# EAGLE design PCB_SCH_1 (EAGLE 8.7.0)
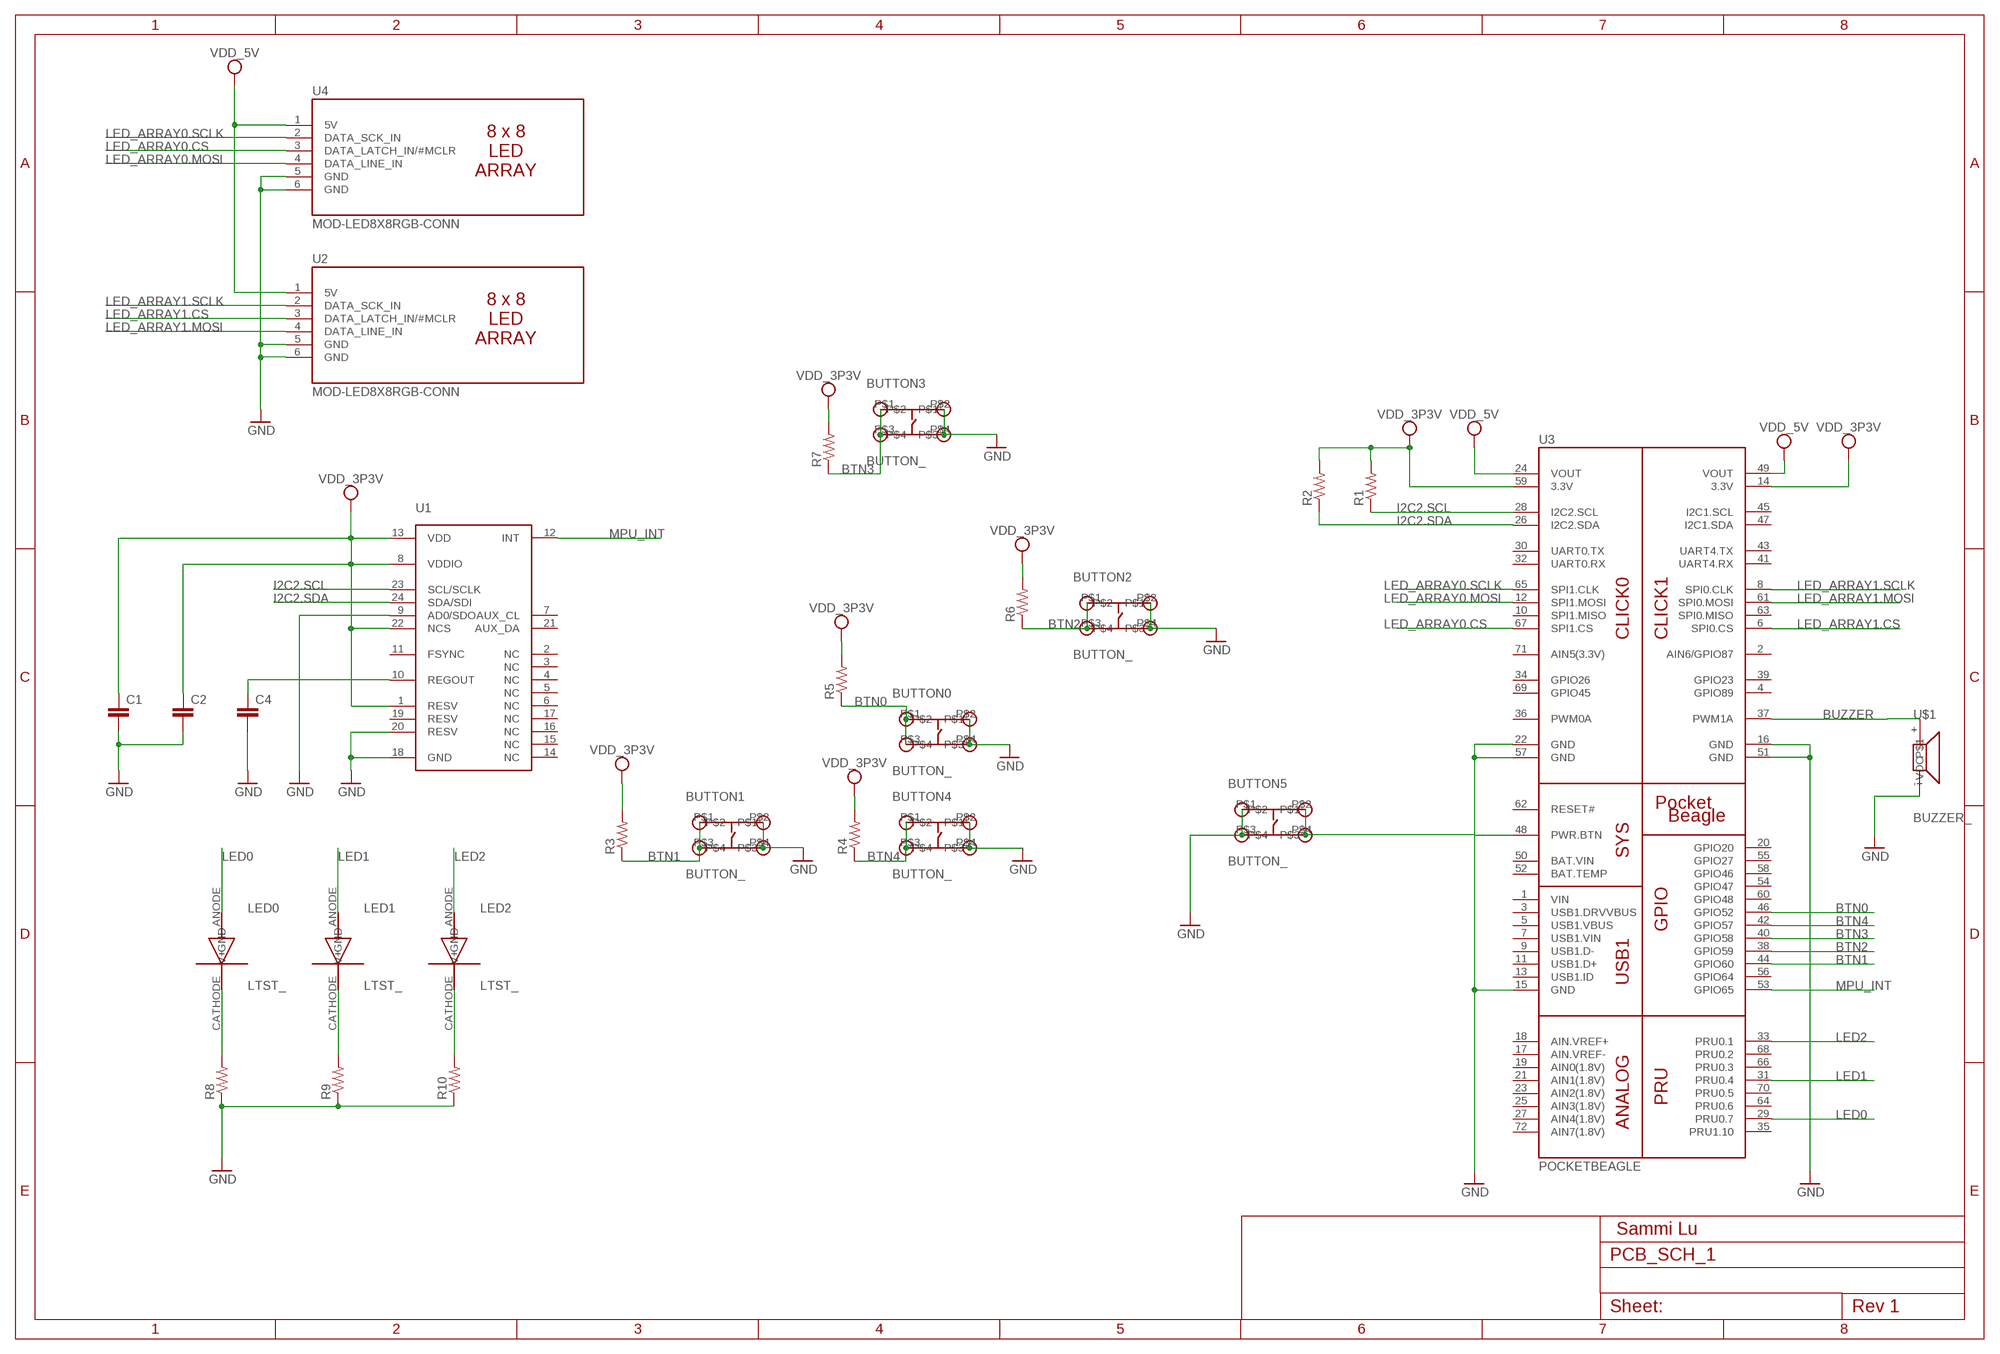
[diagram p0: schematic, sheet 1]

## Parts
BUTTON0  BUTTON_  [115*117]
BUTTON1  BUTTON_  [115*117]
BUTTON2  BUTTON_  [115*117]
BUTTON3  BUTTON_  [115*117]
BUTTON4  BUTTON_  [115*117]
BUTTON5  BUTTON_  [115*117]
C1  C_C0603  [C0603]
C2  C_C0603  [C0603]
C4  C_C0603  [C0603]
LED0  LTST_  [1.6*0.8]
LED1  LTST_  [1.6*0.8]
LED2  LTST_  [1.6*0.8]
R1  R_R2012  [R2012]
R2  R_R2012  [R2012]
R3  R_R2012  [R2012]
R4  R_R2012  [R2012]
R5  R_R2012  [R2012]
R6  R_R2012  [R2012]
R7  R_R2012  [R2012]
R8  R_R1005  [R1005]
R9  R_R1005  [R1005]
R10  R_R1005  [R1005]
U1  MPU_9250  [QFN-3MM*3MM]
U2  MOD-LED8X8RGB-CONN  [FE06W]
U3  POCKETBEAGLE  [POCKETBEAGLE]
U4  MOD-LED8X8RGB-CONN  [FE06W]
U$1  BUZZER_  [12CIRCLE]

## Nets
BTN0: BUTTON0.P$1 BUTTON0.P$3 R5.1 U3.46(GPIO52)
BTN1: BUTTON1.P$1 BUTTON1.P$3 R3.1 U3.44(GPIO60)
BTN2: BUTTON2.P$1 BUTTON2.P$3 R6.1 U3.38(GPIO59)
BTN3: BUTTON3.P$1 BUTTON3.P$3 R7.1 U3.40(GPIO58)
BTN4: BUTTON4.P$1 BUTTON4.P$3 R4.1 U3.42(GPIO57)
BUZZER: U3.37(PWM1A) U$1.+(+VDC)
GND: BUTTON0.P$2 BUTTON0.P$4 BUTTON1.P$2 BUTTON1.P$4 BUTTON2.P$2 BUTTON2.P$4 BUTTON3.P$2 BUTTON3.P$4 BUTTON4.P$2 BUTTON4.P$4 BUTTON5.P$1 BUTTON5.P$3 C1.2 C2.2 C4.2 R8.1 R9.1 R10.1 U1.9(AD0/SDO) U1.18(GND) U1.20(RESV) U2.5(GND) U2.6(GND) U3.15(GND) U3.16(GND) U3.48(PWR.BTN) U3.51(GND) U4.5(GND) U4.6(GND) U$1.-
I2C2.SCL: R1.1 U1.23(SCL/SCLK) U3.28(I2C2.SCL)
I2C2.SDA: R2.1 U1.24(SDA/SDI) U3.26(I2C2.SDA)
LED0: LED0.ANODE(V+) U3.29(PRU0.7)
LED1: LED1.ANODE(V+) U3.31(PRU0.4)
LED2: LED2.ANODE(V+) U3.33(PRU0.1)
LED_ARRAY0.CS: U3.67(SPI1.CS) U4.3(DATA_LATCH_IN/#MCLR)
LED_ARRAY0.MOSI: U3.12(SPI1.MOSI) U4.4(DATA_LINE_IN)
LED_ARRAY0.SCLK: U3.65(SPI1.CLK) U4.2(DATA_SCK_IN)
LED_ARRAY1.CS: U2.3(DATA_LATCH_IN/#MCLR) U3.6(SPI0.CS)
LED_ARRAY1.MOSI: U2.4(DATA_LINE_IN) U3.61(SPI0.MOSI)
LED_ARRAY1.SCLK: U2.2(DATA_SCK_IN) U3.8(SPI0.CLK)
MPU_INT: U1.12(INT) U3.53(GPIO65)
N$7: BUTTON5.P$2 BUTTON5.P$4 U3.22(GND) U3.57(GND)
N$30: C4.1 U1.10(REGOUT)
N$32: LED0.CATHODE(GND) R8.2
N$34: LED1.CATHODE(GND) R9.2
N$35: LED2.CATHODE(GND) R10.2
SYS_VDD1_3P3V: C1.1 C2.1 R1.2 R2.2 R3.2 R4.2 R5.2 R6.2 R7.2 U1.1(RESV) U1.8(VDDIO) U1.13(VDD) U1.22(NCS) U3.14(3.3V) U3.59(3.3V) ; supply symbol labelled VDD_3P3V
VDD_5V: U2.1(5V) U3.24(VOUT) U3.49(VOUT) U4.1(5V)
Unconnected: U1.2(NC) U1.3(NC) U1.4(NC) U1.5(NC) U1.6(NC) U1.7(AUX_CL) U1.11(FSYNC) U1.14(NC) U1.15(NC) U1.16(NC) U1.17(NC) U1.19(RESV) U1.21(AUX_DA) U3.1(VIN) U3.2(AIN6/GPIO87) U3.3(USB1.DRVVBUS) U3.4(GPIO89) U3.5(USB1.VBUS) U3.7(USB1.VIN) U3.9(USB1.D-) U3.10(SPI1.MISO) U3.11(USB1.D+) U3.13(USB1.ID) U3.17(AIN.VREF-) U3.18(AIN.VREF+) U3.19(AIN0(1.8V)) U3.20(GPIO20) U3.21(AIN1(1.8V)) U3.23(AIN2(1.8V)) U3.25(AIN3(1.8V)) U3.27(AIN4(1.8V)) U3.30(UART0.TX) U3.32(UART0.RX) U3.34(GPIO26) U3.35(PRU1.10) U3.36(PWM0A) U3.39(GPIO23) U3.41(UART4.RX) U3.43(UART4.TX) U3.45(I2C1.SCL) U3.47(I2C1.SDA) U3.50(BAT.VIN) U3.52(BAT.TEMP) U3.54(GPIO47) U3.55(GPIO27) U3.56(GPIO64) U3.58(GPIO46) U3.60(GPIO48) U3.62(RESET#) U3.63(SPI0.MISO) U3.64(PRU0.6) U3.66(PRU0.3) U3.68(PRU0.2) U3.69(GPIO45) U3.70(PRU0.5) U3.71(AIN5(3.3V)) U3.72(AIN7(1.8V))

## Notes on the sheet
- Sammi Lu

## Library data of the parts
BUTTON0 BUTTON1-BUTTON5 = PCB_design_1:BUTTON_
C1 C2 C4 = PCB_design_1:C_: Capacitor SMD. Sizes: 0402, 0603 & 0805
LED0 LED1 LED2 = PCB_design_1:LTST_
R1-R10 = ENGI301_design_example:R_: RESISTOR, American symbol
U1 = PCB_design_1:MPU_9250
U2 U4 = ENGI301_Maze_Project_Parts:MOD-LED8X8RGB-CONN
U3 = ENGI301_Maze_Project_Parts:POCKETBEAGLE
U$1 = PCB_design_1:BUZZER_

## Board
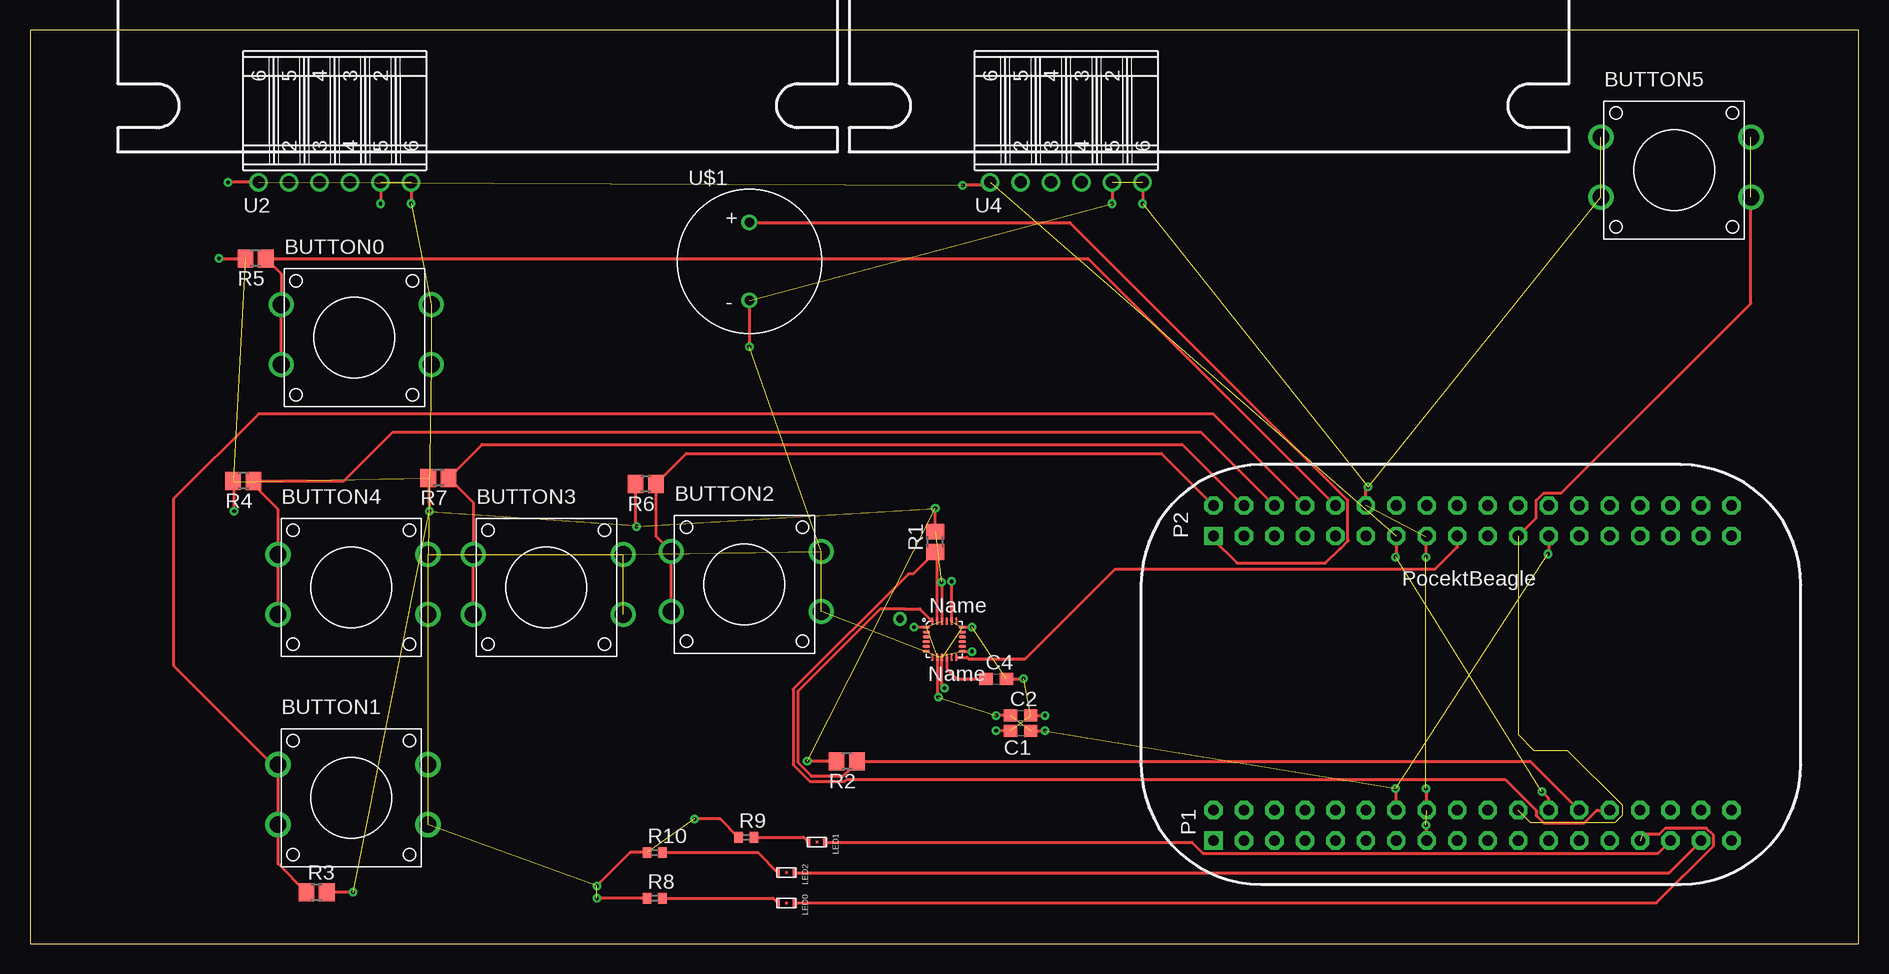
[diagram p1: board, top side]
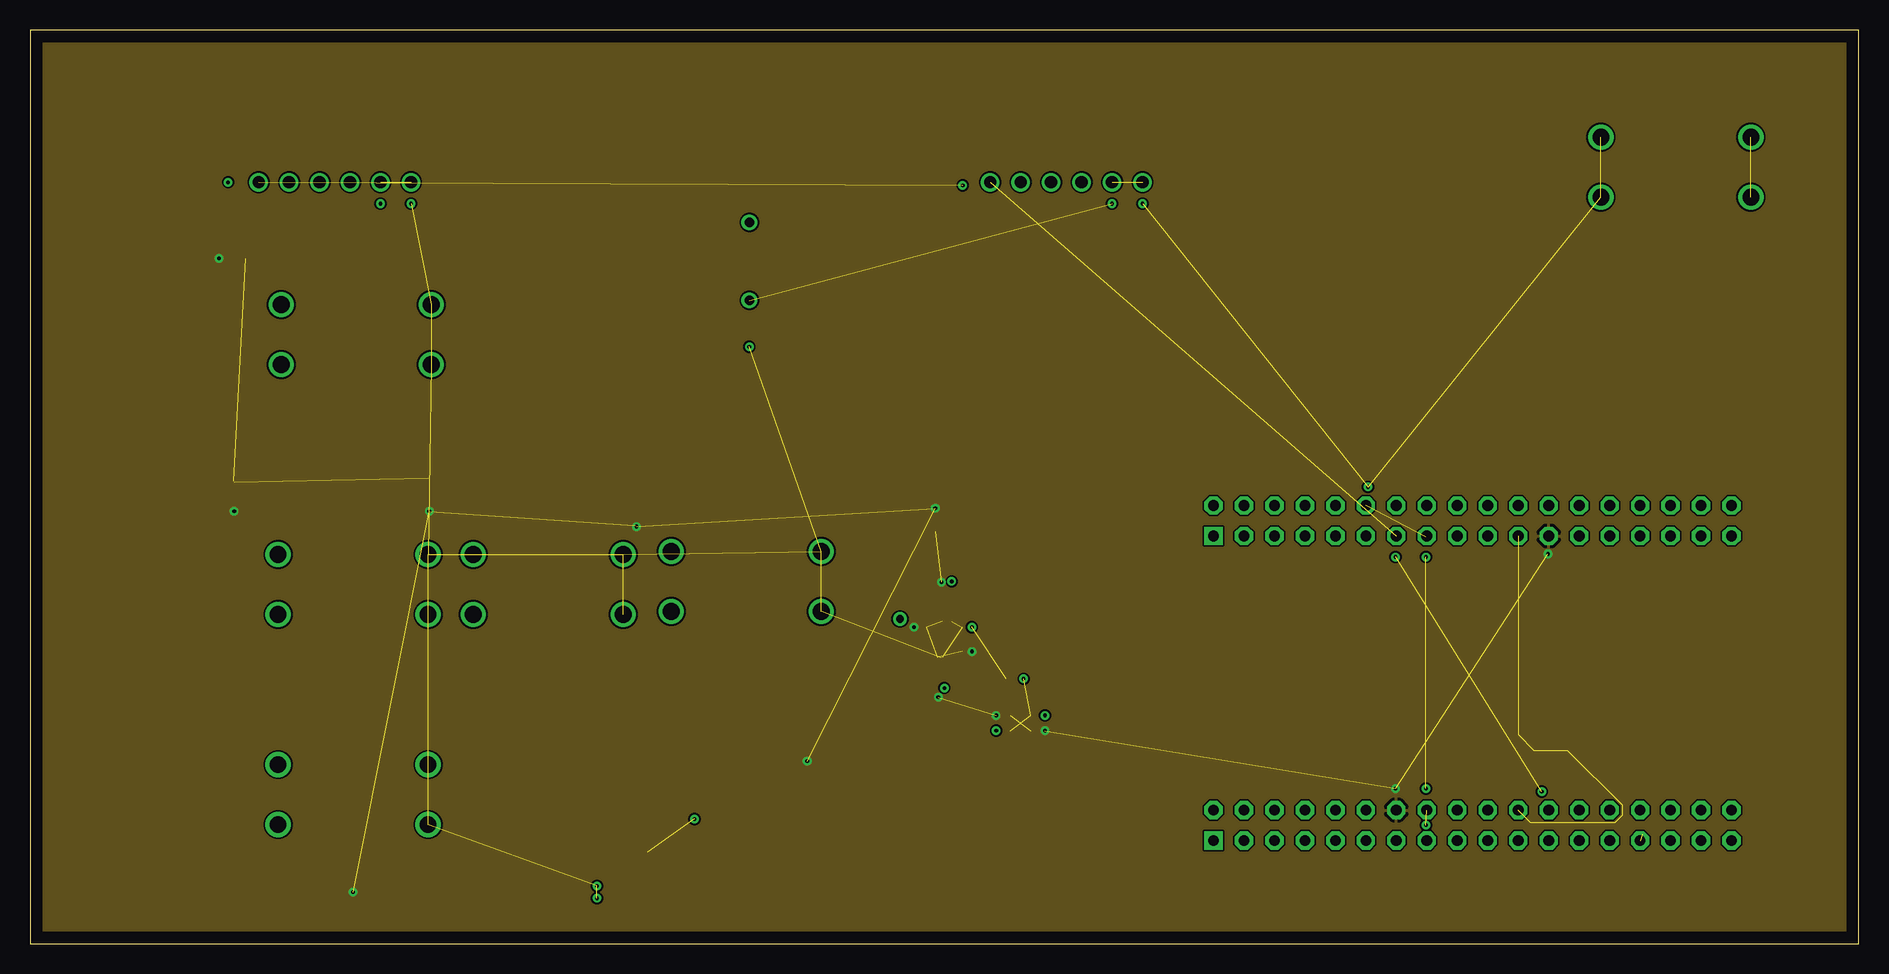
[diagram p2: board, inner layer Route2]
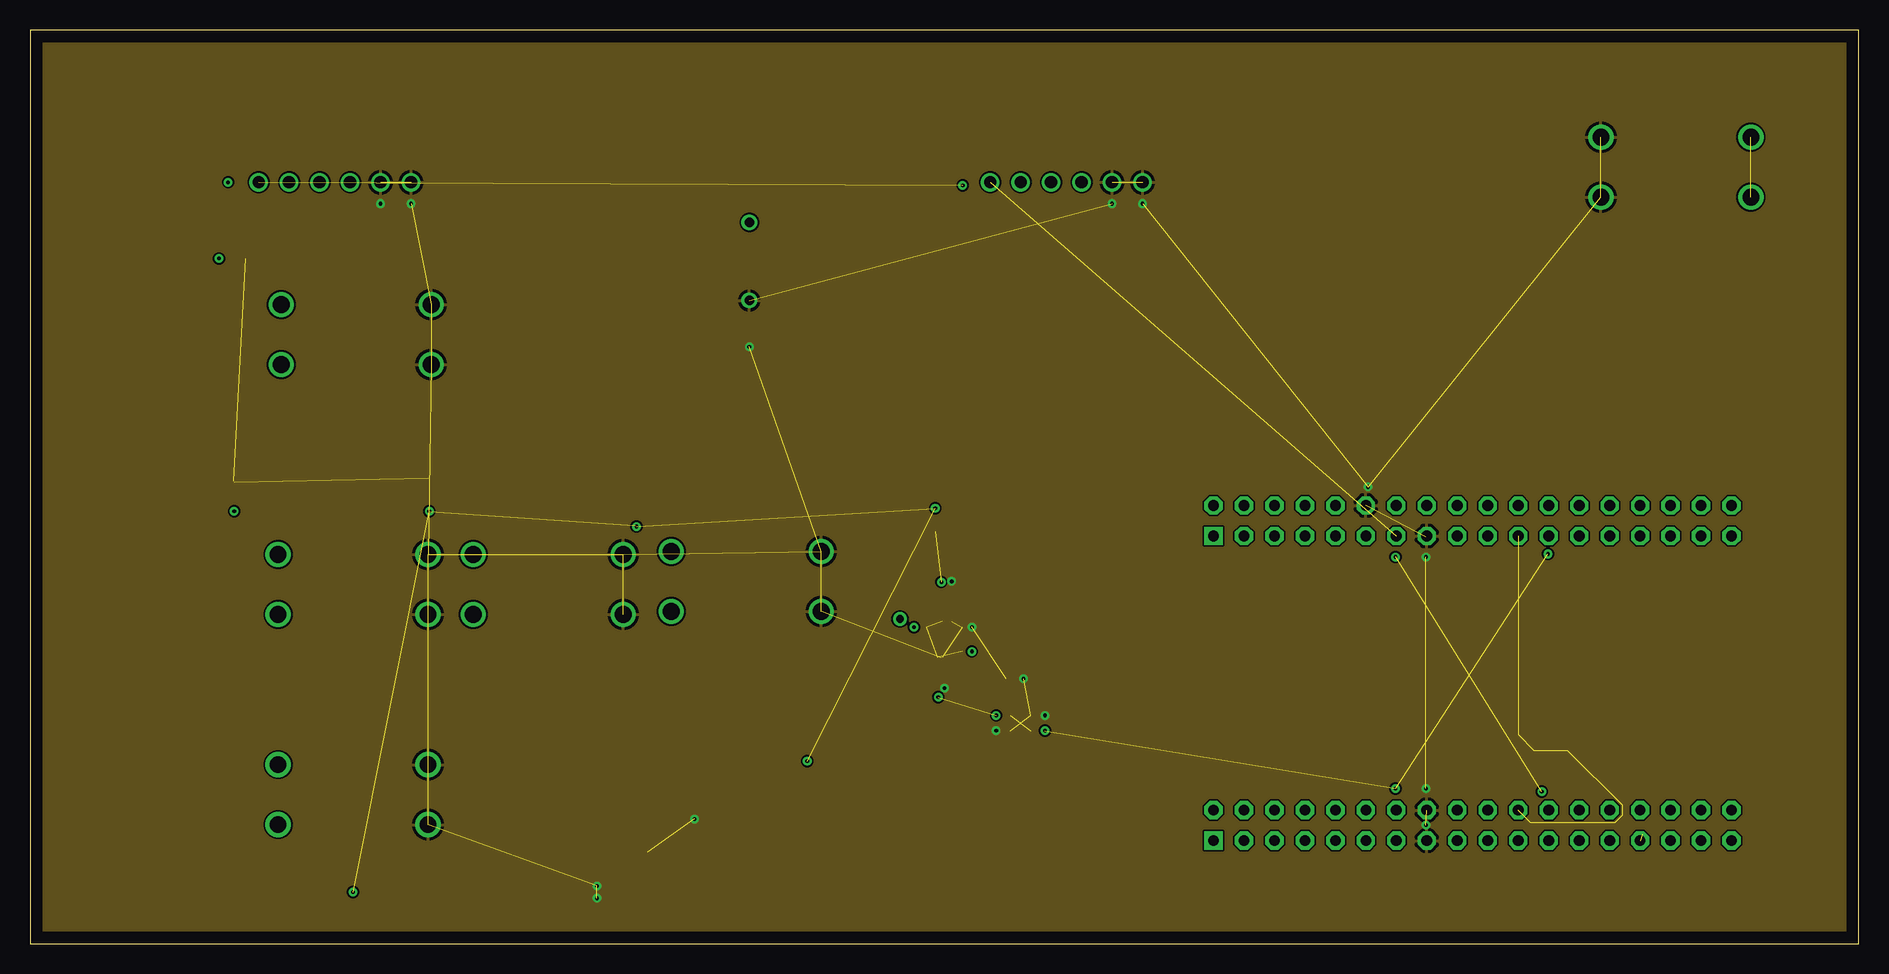
[diagram p3: board, inner layer Route15]
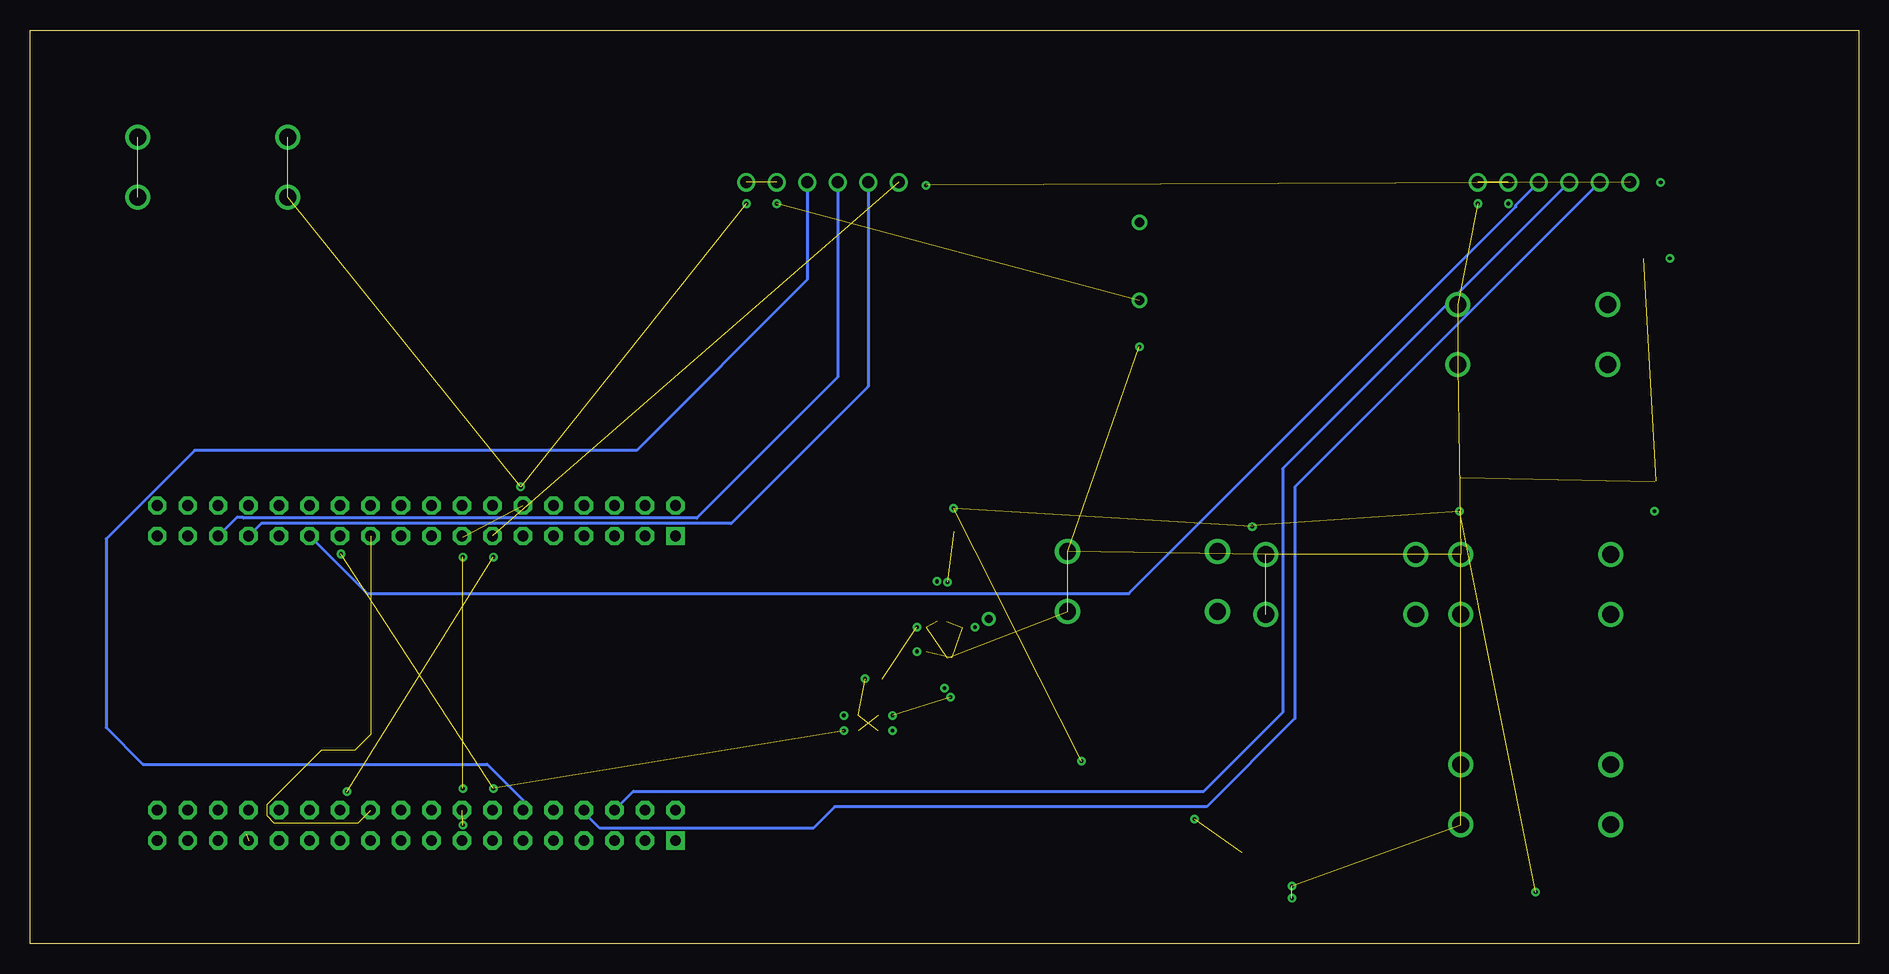
[diagram p4: board, bottom side, seen from below]

Size 152.4 x 76.2 mm. Coordinates in mm from the lower left corner, seen from the top.
Outline: 0,0 152.4,0 152.4,76.2 0,76.2 0,0
Copper layers (1*16): Top 0.035mm / dielectric 1.5mm / Bottom 0.035mm
Design rules "default": minimum track width 6mil, minimum drill 0.35mm, track to track 6mil, track to pad 6mil, pad to pad 6mil, via to via 6mil, smd to smd 6mil, copper to edge 40mil, drill to drill 6mil, minimum pad ring 10mil, minimum via ring 8mil, stop-mask expansion 4mil, vias tented up to drill 0mil, thermal gap 10mil

### Footprints (pad centres in the part's own frame; a part is rotated, then mirrored left to right if it is on the bottom)
115*117 = drill 1.4: P$1 -6.25,2.5; P$2 6.25,2.5; P$3 -6.25,-2.5; P$4 6.25,-2.5
C0603 = smd 1.1 x 1: 1 -0.85,0; 2 0.85,0
1.6*0.8 = smd 0.8 x 0.3: ANODE 0.4,1.5; CATHODE 0.4,0.1
R2012 = smd 1.3 x 1.5: 1 -0.85,0; 2 0.85,0
R1005 = smd 0.7 x 0.9: 1 -0.65,0; 2 0.65,0
QFN-3MM*3MM = smd 0.6 x 0.2: 1 -1.5,1; 2 -1.5,0.6; 3 -1.5,0.2; 4 -1.5,-0.2; 5 -1.5,-0.6; 6 -1.5,-1; 13 1.5,-1; 14 1.5,-0.6; 15 1.5,-0.2; 16 1.5,0.2; 17 1.5,0.6; 18 1.5,1 | smd 0.2 x 0.6: 7 -1,-1.5; 8 -0.6,-1.5; 9 -0.2,-1.5; 10 0.2,-1.5; 11 0.6,-1.5; 12 1,-1.5; 19 1,1.5; 20 0.6,1.5; 21 0.2,1.5; 22 -0.2,1.5; 23 -0.6,1.5; 24 -1,1.5 | drill 0.635: P$1 -3.7,1.7
FE06W = drill 1.016: 1 -6.35,0; 2 -3.81,0; 3 -1.27,0; 4 1.27,0; 5 3.81,0; 6 6.35,0
POCKETBEAGLE = drill 0.889 pad 1.524 square: 1 5.91,3.53; 37 5.91,28.93 | drill 0.889 pad 1.524 octagon: 2 5.91,6.07; 3 8.45,3.53; 4 8.45,6.07; 5 10.99,3.53; 6 10.99,6.07; 7 13.53,3.53; 8 13.53,6.07; 9 16.07,3.53; 10 16.07,6.07; 11 18.61,3.53; 12 18.61,6.07; 13 21.15,3.53; 14 21.15,6.07; 15 23.69,3.53; 16 23.69,6.07; 17 26.23,3.53; 18 26.23,6.07; 19 28.77,3.53; 20 28.77,6.07; 21 31.31,3.53; 22 31.31,6.07; 23 33.85,3.53; 24 33.85,6.07; 25 36.39,3.53; 26 36.39,6.07; 27 38.93,3.53; 28 38.93,6.07; 29 41.47,3.53; 30 41.47,6.07; 31 44.01,3.53; 32 44.01,6.07; 33 46.55,3.53; 34 46.55,6.07; 35 49.09,3.53; 36 49.09,6.07; 38 5.91,31.47; 39 8.45,28.93; 40 8.45,31.47; 41 10.99,28.93; 42 10.99,31.47; 43 13.53,28.93; 44 13.53,31.47; 45 16.07,28.93; 46 16.07,31.47; 47 18.61,28.93; 48 18.61,31.47; 49 21.15,28.93; 50 21.15,31.47; 51 23.69,28.93; 52 23.69,31.47; 53 26.23,28.93; 54 26.23,31.47; 55 28.77,28.93; 56 28.77,31.47; 57 31.31,28.93; 58 31.31,31.47; 59 33.85,28.93; 60 33.85,31.47; 61 36.39,28.93; 62 36.39,31.47; 63 38.93,28.93; 64 38.93,31.47; 65 41.47,28.93; 66 41.47,31.47; 67 44.01,28.93; 68 44.01,31.47; 69 46.55,28.93; 70 46.55,31.47; 71 49.09,28.93; 72 49.09,31.47
12CIRCLE = drill 0.8: + 0,3.25; - 0,-3.25

### Placement (x,y rotation side)
BUTTON0  27.18,50.8 0 top
BUTTON1  26.92,12.45 0 top
BUTTON2  59.69,30.23 0 top
BUTTON3  43.18,29.97 0 top
BUTTON4  26.92,29.97 0 top
BUTTON5  137.16,64.77 0 top
C1  82.55,17.78 180 top
C2  82.55,19.05 0 top
C4  80.52,22.1 0 top
LED0  62.23,3.81 270 top
LED1  64.77,8.89 270 top
LED2  62.23,6.35 270 top
R1  75.44,33.53 90 top
R2  68.07,15.24 180 top
R3  23.88,4.32 0 top
R4  17.78,38.61 180 top
R5  18.8,57.15 180 top
R6  51.31,38.35 180 top
R7  34.04,38.86 180 top
R8  52.07,3.81 0 top
R9  59.69,8.89 0 top
R10  52.07,7.62 0 top
U1  76.2,25.4 0 top
U2  25.4,63.5 0 top
U3  92.71,5.08 0 top
U4  86.36,63.5 0 top
U$1  59.94,56.9 0 top
U$2  [MOD-LED8X8RGB]  67.31,66.04 90 top
U$3  [MOD-LED8X8RGB]  128.27,66.04 90 top

### Tracks (layer width: path | path; a pad name or v marks a point on that pad's centre or on a via)
BTN0
  Top 0.254: BUTTON0.P$3 BUTTON0.P$1 20.93,55.87 R5.1 88.18,57.15 99.61,45.72 100.48,44.85 U3.46
BTN1
  Top 0.254: 20.67,14.48 BUTTON1.P$3 20.67,6.67 R3.1 | 20.67,14.48 BUTTON1.P$1 | U3.44 98.59,44.2 19.05,44.2 11.94,37.08 11.94,23.21 20.67,14.48
BTN2
  Top 0.254: BUTTON2.P$3 BUTTON2.P$1 52.16,34.01 R6.1 54.7,40.89 94.28,40.89 U3.38
BTN3
  Top 0.254: BUTTON3.P$3 BUTTON3.P$1 36.93,36.82 R7.1 37.68,41.66 96.01,41.66 101.6,36.07 101.6,36.11 U3.40
BTN4
  Top 0.254: U3.42 97.58,42.67 30.23,42.67 26.16,38.61 R4.1 | R4.1 18.63,38.43 18.59,38.39 | R4.1 18.63,38.27 20.67,36.22 BUTTON4.P$1 BUTTON4.P$3
BUZZER
  Top 0.254: U$1.+ 86.66,60.15 109.82,36.98 109.82,33.69 109.86,33.66 109.82,33.62 109.82,33.58 109.21,32.97 109.17,32.97 107.95,31.75 100.58,31.75 98.62,33.71 U3.37
GND  (via drill 0.3)  (29 unrouted)
  Top 0.254: R8.1 v47.24,3.81 | R10.1 50.04,7.62 v47.24,4.83 | R9.1 57.52,10.41 v55.37,10.41 | U1.9 75.95,23.85 75.95,21.59 v76.2,21.34 | U1.18 77.72,26.42 v78.49,26.42 | C4.2 v82.8,22.1 | C1.2 v80.52,17.78 | C2.2 v84.58,19.05 | U3.51 116.33,33.94 v116.33,32.26 | U3.48 111.32,37.91 v111.51,38.1 | U3.16 116.4,12.89 v116.33,12.95 | U3.15 116.4,9.84 v116.33,9.91 | U$1.- v59.94,49.78 | U2.5 v29.21,61.72 | U2.6 v31.75,61.72 | U4.5 v90.17,61.72 | U4.6 v92.71,61.72 | U1.20 76.8,30.22 v76.81,30.23
  pour Route15: -2.54,106.68 -7.62,101.6 -7.62,-2.54 0,-10.16 160.02,-10.16 167.64,-2.54 167.64,101.6 162.56,106.68 157.48,106.68
I2C2.SCL
  Top 0.254: U1.23 75.6,32.52 R1.1 73.62,30.86 73.21,30.86 63.6,21.25 63.6,14.94 64.97,13.56 67.92,13.56 68.07,13.72 122.93,13.72 125.52,11.12 125.52,10.72 126.13,10.11 129.53,10.11 130.57,11.15 U3.28
I2C2.SDA
  Top 0.254: U3.26 125.01,15.24 R2.1 68.15,14.47 68.15,14.37 67.75,13.97 65.14,13.97 64.01,15.1 64.01,21.08 70.88,27.95 72.85,27.95 72.86,27.94 74.16,27.94 U1.24
LED0  (1 unrouted)
  Top 0.254: 134.37,9.14 135.78,9.14 136.29,9.65 139.69,9.65 140.3,9.04 140.3,8.18 135.53,3.41 LED0.ANODE
LED1
  Top 0.254: LED1.ANODE 96.82,8.49 97.74,7.57 135.68,7.57 U3.31
LED2
  Top 0.254: LED2.ANODE 136.6,5.95 U3.33
LED_ARRAY0.CS
  Bottom 0.254: U4.3 85.09,47.24 96.83,35.51 134.61,35.51 134.66,35.56 135.17,35.56 U3.67
LED_ARRAY0.MOSI
  Bottom 0.254: U4.4 87.63,55.37 101.85,41.15 138.68,41.15 146.05,33.78 146.05,18.03 143,14.99 114.3,14.99 111.32,12.01 U3.12
LED_ARRAY0.SCLK
  Bottom 0.254: U4.2 82.55,46.48 93.98,35.05 133.14,35.05 U3.65
LED_ARRAY1.CS
  Bottom 0.254: U2.3 48.01,39.62 48.01,19.3 54.61,12.7 102.11,12.7 102.13,12.72 U3.6
LED_ARRAY1.MOSI
  Bottom 0.254: U3.61 124.3,29.21 60.82,29.21 28.57,61.46 28.57,61.59 U2.4
LED_ARRAY1.SCLK
  Bottom 0.254: U2.2 46.99,38.1 46.99,18.8 54.36,11.43 85.34,11.43 87.12,9.65 104.9,9.65 106.24,10.99 U3.8
MPU_INT
  Top 0.254: U1.12 78.07,23.9 78.22,23.75 82.93,23.75 90.42,31.24 117.09,31.24 118.94,33.09 U3.53
N$7  (9 unrouted)
  Top 0.254: BUTTON5.P$4 143.41,53.4 127.6,37.59 126.13,37.59 125.52,36.98 125.52,35.51 U3.57
N$30
  Top 0.254: C4.1 78.49,22.1 78.2,22.1 77.22,22.1 76.4,22.91 U1.10
N$32
  Top 0.254: R8.2 61.93,3.81 LED0.CATHODE
N$34
  Top 0.254: R9.2 64.47,8.89 LED1.CATHODE
N$35
  Top 0.254: R10.2 60.66,7.62 LED2.CATHODE
SYS_VDD1_3P3V  (via drill 0.3)  (14 unrouted)
  Top 0.254: R6.2 50.46,34.89 v50.55,34.8 | R7.2 v33.27,36.07 | U1.1 73.68,26.4 v73.66,26.42 | R2.2 v64.77,15.24 | U1.13 77.72,24.38 v78.49,24.38 | C1.1 v84.58,17.78 | C2.1 v80.52,19.05 | R1.2 v75.44,36.32 | U3.14 113.86,12.89 v113.79,12.95 | U3.59 126.56,32.58 v126.49,32.51 | v75.69,20.57 75.6,20.67 U1.8 | v17.02,36.07 17.02,38.52 R4.2 | v26.92,4.32 R3.2 | v15.75,57.15 R5.2 | U1.22 76,30.11 v75.95,30.17
  pour Route2: 0,104.14 -2.54,101.6 -2.54,-2.54 0,-5.08 160.02,-5.08 162.56,-2.54 162.56,101.6 160.02,104.14
VDD_5V  (via drill 0.3)  (3 unrouted)
  Top 0.254: U2.1 v16.51,63.5 | U4.1 79.76,63.25 v77.72,63.25 | U3.49 113.86,32.33 v113.79,32.26 | U3.24 126.56,12.12 v125.98,12.7